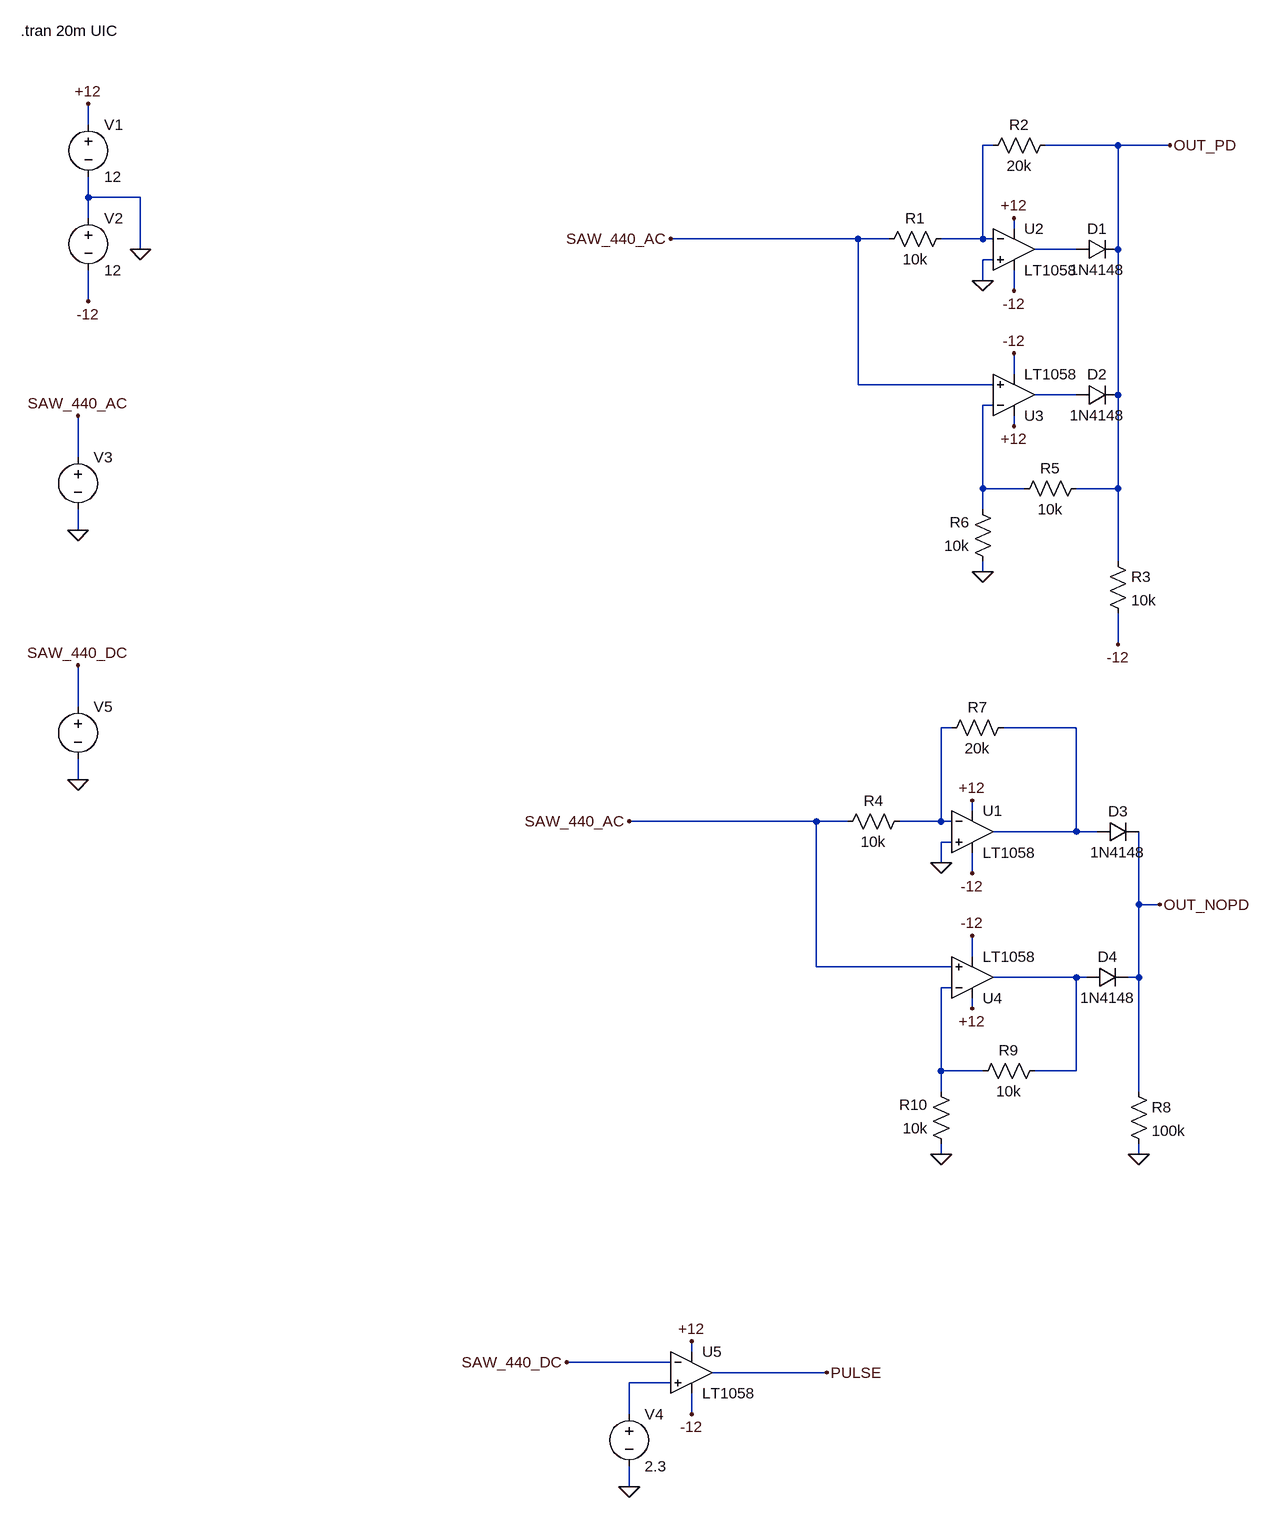
[diagram p0: schematic TriConverterSim.asc]
TriConverterSim.asc, the LTspice schematic file:
Version 4
SHEET 1 2512 2576
WIRE 64 256 64 224
WIRE 1456 288 1440 288
WIRE 1648 288 1536 288
WIRE 1728 288 1648 288
WIRE 64 368 64 336
WIRE 144 368 64 368
WIRE 64 400 64 368
WIRE 1488 416 1488 400
WIRE 1248 432 960 432
WIRE 1296 432 1248 432
WIRE 1440 432 1440 288
WIRE 1440 432 1376 432
WIRE 1456 432 1440 432
WIRE 144 448 144 368
WIRE 1584 448 1520 448
WIRE 1648 448 1648 288
WIRE 1456 464 1440 464
WIRE 1440 496 1440 464
WIRE 1488 512 1488 480
WIRE 64 528 64 480
WIRE 1488 640 1488 608
WIRE 1248 656 1248 432
WIRE 1456 656 1248 656
WIRE 1584 672 1520 672
WIRE 1648 672 1648 448
WIRE 1456 688 1440 688
WIRE 1488 720 1488 704
WIRE 48 768 48 704
WIRE 1440 816 1440 688
WIRE 1504 816 1440 816
WIRE 1648 816 1648 672
WIRE 1648 816 1584 816
WIRE 1440 848 1440 816
WIRE 48 880 48 848
WIRE 1648 928 1648 816
WIRE 1440 944 1440 928
WIRE 1648 1056 1648 1008
WIRE 48 1152 48 1088
WIRE 1392 1184 1376 1184
WIRE 1584 1184 1472 1184
WIRE 48 1264 48 1232
WIRE 1424 1312 1424 1296
WIRE 1184 1328 896 1328
WIRE 1232 1328 1184 1328
WIRE 1376 1328 1376 1184
WIRE 1376 1328 1312 1328
WIRE 1392 1328 1376 1328
WIRE 1584 1344 1584 1184
WIRE 1584 1344 1456 1344
WIRE 1616 1344 1584 1344
WIRE 1392 1360 1376 1360
WIRE 1376 1392 1376 1360
WIRE 1424 1408 1424 1376
WIRE 1680 1456 1680 1344
WIRE 1712 1456 1680 1456
WIRE 1424 1536 1424 1504
WIRE 1184 1552 1184 1328
WIRE 1392 1552 1184 1552
WIRE 1584 1568 1456 1568
WIRE 1600 1568 1584 1568
WIRE 1680 1568 1680 1456
WIRE 1680 1568 1664 1568
WIRE 1392 1584 1376 1584
WIRE 1424 1616 1424 1600
WIRE 1376 1712 1376 1584
WIRE 1440 1712 1376 1712
WIRE 1584 1712 1584 1568
WIRE 1584 1712 1520 1712
WIRE 1376 1744 1376 1712
WIRE 1680 1744 1680 1568
WIRE 1376 1840 1376 1824
WIRE 1680 1840 1680 1824
WIRE 992 2144 992 2128
WIRE 960 2160 800 2160
WIRE 1200 2176 1024 2176
WIRE 960 2192 896 2192
WIRE 896 2240 896 2192
WIRE 992 2240 992 2208
WIRE 896 2352 896 2320
FLAG 64 224 +12
FLAG 64 528 -12
FLAG 144 448 0
FLAG 48 880 0
FLAG 48 704 SAW_440_AC
FLAG 1488 400 +12
FLAG 1488 512 -12
FLAG 1440 496 0
FLAG 1648 1056 -12
FLAG 1488 720 +12
FLAG 1488 608 -12
FLAG 1440 944 0
FLAG 960 432 SAW_440_AC
FLAG 1728 288 OUT_PD
FLAG 1424 1296 +12
FLAG 1424 1408 -12
FLAG 1376 1392 0
FLAG 1424 1616 +12
FLAG 1424 1504 -12
FLAG 1376 1840 0
FLAG 896 1328 SAW_440_AC
FLAG 1712 1456 OUT_NOPD
FLAG 1680 1840 0
FLAG 992 2128 +12
FLAG 992 2240 -12
FLAG 896 2352 0
FLAG 800 2160 SAW_440_DC
FLAG 1200 2176 PULSE
FLAG 48 1264 0
FLAG 48 1088 SAW_440_DC
SYMBOL voltage 64 240 R0
SYMATTR InstName V1
SYMATTR Value 12
SYMBOL voltage 64 384 R0
SYMATTR InstName V2
SYMATTR Value 12
SYMBOL voltage 48 752 R0
WINDOW 3 24 96 Invisible 2
SYMATTR Value PULSE(-1.65 1.65 0 0.239ms 1000ns 0 0.239ms)
SYMATTR InstName V3
SYMBOL OpAmps/LT1058 1488 384 R0
SYMATTR InstName U2
SYMBOL res 1392 416 R90
WINDOW 0 0 56 VBottom 2
WINDOW 3 32 56 VTop 2
SYMATTR InstName R1
SYMATTR Value 10k
SYMBOL res 1552 272 R90
WINDOW 0 0 56 VBottom 2
WINDOW 3 32 56 VTop 2
SYMATTR InstName R2
SYMATTR Value 20k
SYMBOL diode 1584 464 R270
WINDOW 0 32 32 VTop 2
WINDOW 3 0 32 VBottom 2
SYMATTR InstName D1
SYMATTR Value 1N4148
SYMBOL diode 1584 688 R270
WINDOW 0 32 32 VTop 2
WINDOW 3 0 32 VBottom 2
SYMATTR InstName D2
SYMATTR Value 1N4148
SYMBOL res 1632 912 R0
SYMATTR InstName R3
SYMATTR Value 10k
SYMBOL OpAmps/LT1058 1488 736 M180
SYMATTR InstName U3
SYMBOL res 1600 800 R90
WINDOW 0 0 56 VBottom 2
WINDOW 3 32 56 VTop 2
SYMATTR InstName R5
SYMATTR Value 10k
SYMBOL res 1456 944 R180
WINDOW 0 36 76 Left 2
WINDOW 3 36 40 Left 2
SYMATTR InstName R6
SYMATTR Value 10k
SYMBOL OpAmps/LT1058 1424 1280 R0
SYMATTR InstName U1
SYMBOL res 1328 1312 R90
WINDOW 0 0 56 VBottom 2
WINDOW 3 32 56 VTop 2
SYMATTR InstName R4
SYMATTR Value 10k
SYMBOL res 1488 1168 R90
WINDOW 0 0 56 VBottom 2
WINDOW 3 32 56 VTop 2
SYMATTR InstName R7
SYMATTR Value 20k
SYMBOL diode 1616 1360 R270
WINDOW 0 32 32 VTop 2
WINDOW 3 0 32 VBottom 2
SYMATTR InstName D3
SYMATTR Value 1N4148
SYMBOL diode 1600 1584 R270
WINDOW 0 32 32 VTop 2
WINDOW 3 0 32 VBottom 2
SYMATTR InstName D4
SYMATTR Value 1N4148
SYMBOL OpAmps/LT1058 1424 1632 M180
SYMATTR InstName U4
SYMBOL res 1536 1696 R90
WINDOW 0 0 56 VBottom 2
WINDOW 3 32 56 VTop 2
SYMATTR InstName R9
SYMATTR Value 10k
SYMBOL res 1392 1840 R180
WINDOW 0 36 76 Left 2
WINDOW 3 36 40 Left 2
SYMATTR InstName R10
SYMATTR Value 10k
SYMBOL res 1664 1728 R0
SYMATTR InstName R8
SYMATTR Value 100k
SYMBOL OpAmps/LT1058 992 2112 R0
SYMATTR InstName U5
SYMBOL voltage 896 2224 R0
SYMATTR InstName V4
SYMATTR Value 2.3
SYMBOL voltage 48 1136 R0
WINDOW 3 24 96 Invisible 2
SYMATTR Value PULSE(0 3.3 0 0.239ms 1000ns 0 0.239ms)
SYMATTR InstName V5
TEXT -40 112 Left 2 !.tran 20m UIC

The netlist it stands for:
* TriConverterSim.asc
V1 +12 0 12
V2 0 -12 12
V3 SAW_440_AC 0 PULSE(-1.65 1.65 0 0.239ms 1000ns 0 0.239ms)
XU2 0 N001 +12 -12 N002 LT1057  ; LT1058, pins In+ In- V+ V- OUT
R1 N001 SAW_440_AC 10k
R2 OUT_PD N001 20k
D1 N002 OUT_PD 1N4148
D2 N003 OUT_PD 1N4148
R3 OUT_PD -12 10k
XU3 SAW_440_AC N004 +12 -12 N003 LT1057  ; LT1058, pins In+ In- V+ V- OUT
R5 OUT_PD N004 10k
R6 0 N004 10k
XU1 0 N005 +12 -12 N006 LT1057  ; LT1058, pins In+ In- V+ V- OUT
R4 N005 SAW_440_AC 10k
R7 N006 N005 20k
D3 N006 OUT_NOPD 1N4148
D4 N007 OUT_NOPD 1N4148
XU4 SAW_440_AC N008 +12 -12 N007 LT1057  ; LT1058, pins In+ In- V+ V- OUT
R9 N007 N008 10k
R10 0 N008 10k
R8 OUT_NOPD 0 100k
XU5 N009 SAW_440_DC +12 -12 PULSE LT1057  ; LT1058, pins In+ In- V+ V- OUT
V4 N009 0 2.3
V5 SAW_440_DC 0 PULSE(0 3.3 0 0.239ms 1000ns 0 0.239ms)
.model D D
.lib standard.dio
.tran 20m UIC
.lib LTC.lib
.backanno
.end